# EAGLE design Challenger-2040 (EAGLE 9.6.2)
COMPANY: Invector Labs; DRAWN: P. Oldberg; DRGNO: 10/98-00168-1; REV: 0.2

## Sheet 1 of 2
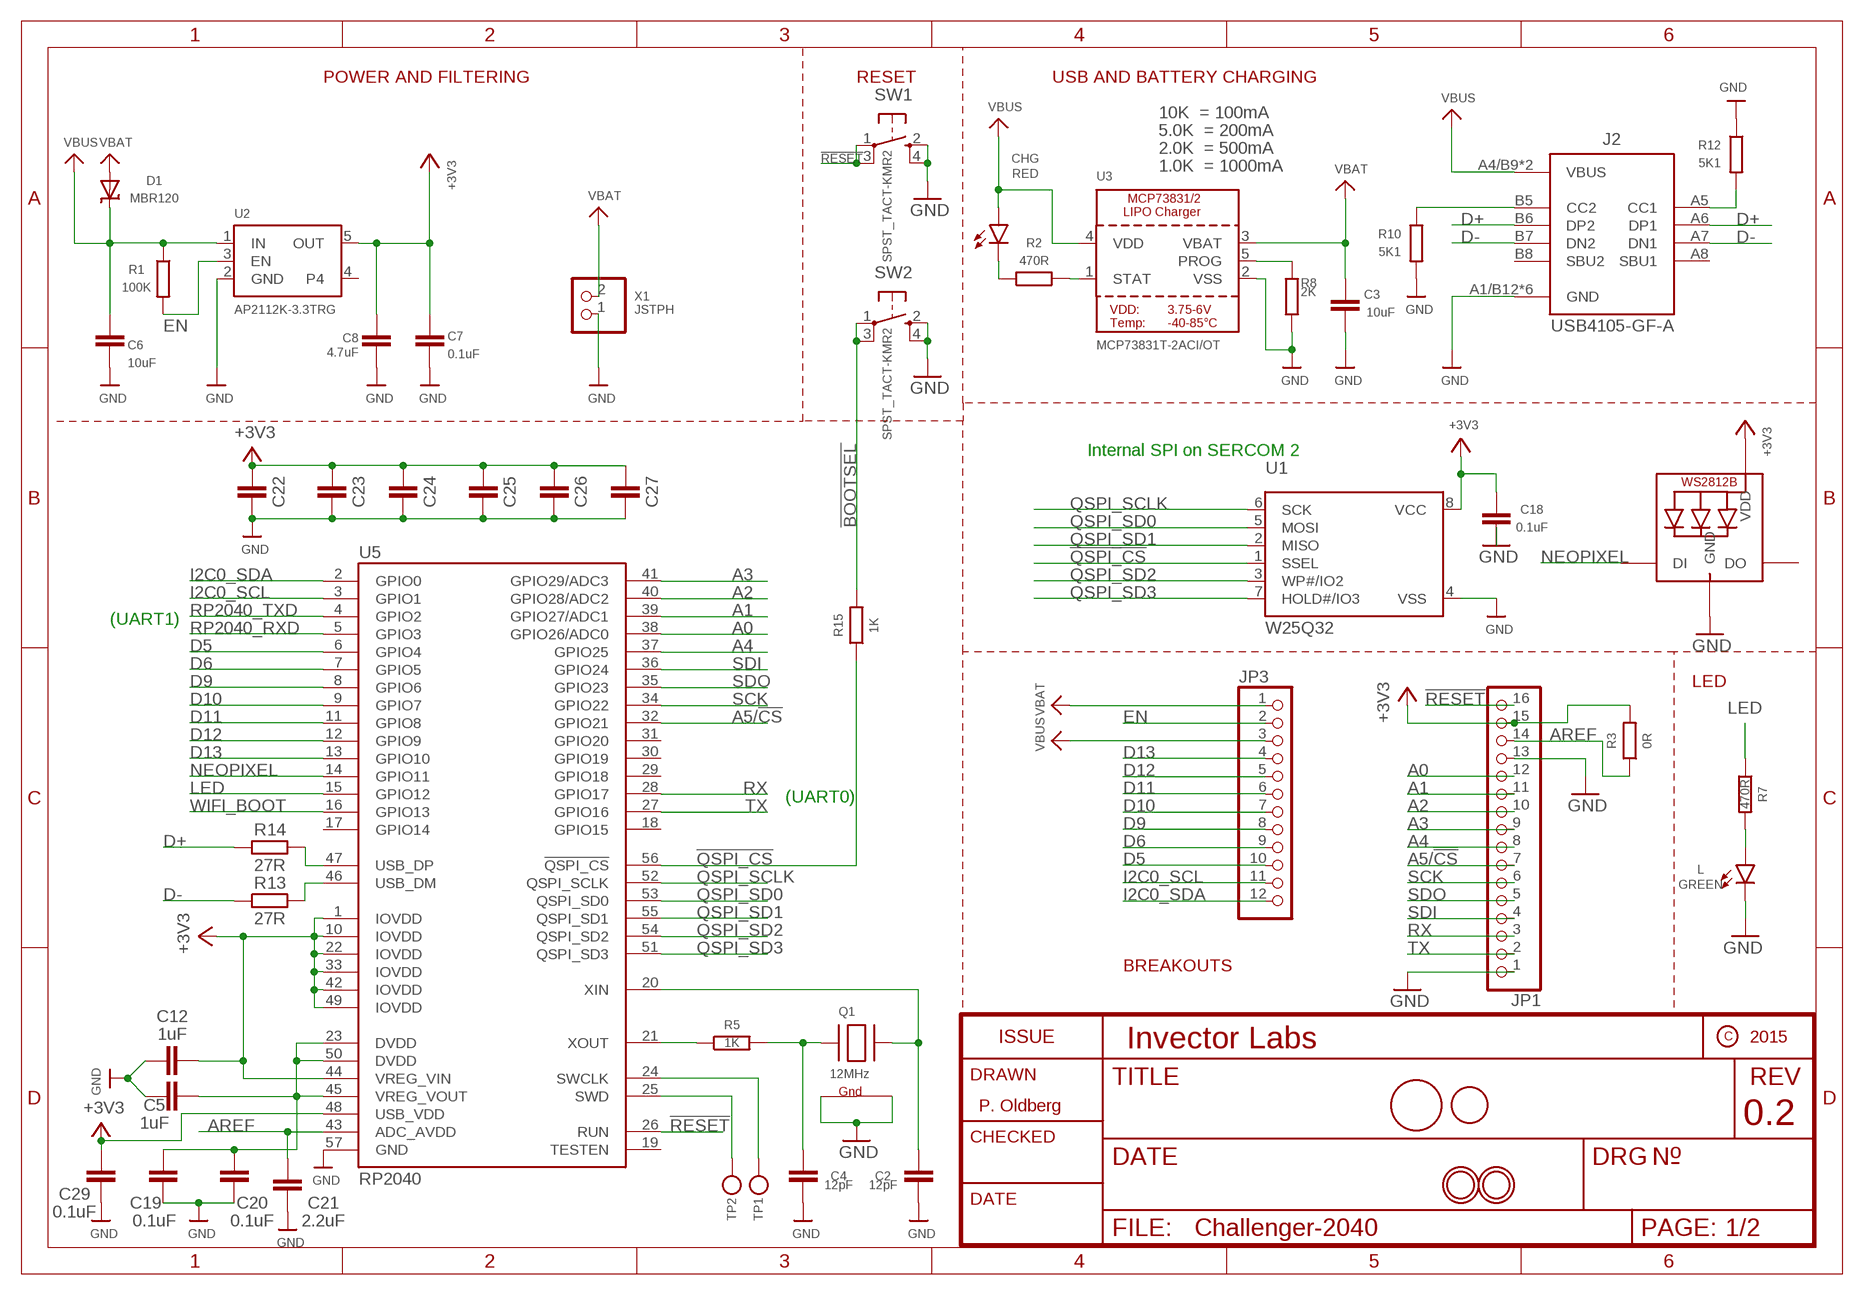
[diagram p0: schematic, sheet 1]

### Parts
C2  12pF  C_CHIP-0402(1005-METRIC)  [CAPC1005X60]
C3  10uF  C_CHIP-0603(1608-METRIC)  [CAPC1608X85]
C4  12pF  C_CHIP-0402(1005-METRIC)  [CAPC1005X60]
C5  1uF  C_CHIP-0402(1005-METRIC)  [CAPC1005X60]
C6  10uF  C_CHIP-0603(1608-METRIC)  [CAPC1608X85]
C7  0.1uF  C_CHIP-0402(1005-METRIC)  [CAPC1005X60]
C8  4.7uF  C_CHIP-0402(1005-METRIC)  [CAPC1005X60]
C12  1uF  C_CHIP-0402(1005-METRIC)  [CAPC1005X60]
C18  0.1uF  C_CHIP-0402(1005-METRIC)  [CAPC1005X60]
C19  0.1uF  C_CHIP-0402(1005-METRIC)  [CAPC1005X60]
C20  0.1uF  C_CHIP-0402(1005-METRIC)  [CAPC1005X60]
C21  2.2uF  C_CHIP-0402(1005-METRIC)  [CAPC1005X60]
C22  C_CHIP-0402(1005-METRIC)  [CAPC1005X60]
C23  C_CHIP-0402(1005-METRIC)  [CAPC1005X60]
C24  C_CHIP-0402(1005-METRIC)  [CAPC1005X60]
C25  C_CHIP-0402(1005-METRIC)  [CAPC1005X60]
C26  C_CHIP-0402(1005-METRIC)  [CAPC1005X60]
C27  C_CHIP-0402(1005-METRIC)  [CAPC1005X60]
C29  0.1uF  C_CHIP-0402(1005-METRIC)  [CAPC1005X60]
CHG  RED  LEDCHIPLED_0603  [CHIPLED_0603]
D1  MBR120  DIODE-SCHOTTKYSOD-123  [SOD-123]
J2  USB4105-GF-A  [GCT_USB4105-GF-A]
JP1  HEADER-1X16ROUND  [1X16_ROUND]
JP3  HEADER-1X12  [1X12_ROUND]
L  GREEN  LEDCHIPLED_0603  [CHIPLED_0603]
LED1  WS2812B3535  [LED3535]
LOGO1  CHALENGER-11MM  [CHALLENGER]
Q1  12MHz  XTAL-4-3225  [NX3225]
R1  100K  R_CHIP-0402(1005-METRIC)  [RESC1005X40]
R2  470R  R_CHIP-0402(1005-METRIC)  [RESC1005X40]
R3  0R  R_CHIP-0402(1005-METRIC)  [RESC1005X40]
R5  1K  R_CHIP-0402(1005-METRIC)  [RESC1005X40]
R7  470R  R_CHIP-0402(1005-METRIC)  [RESC1005X40]
R8  2K  R_CHIP-0402(1005-METRIC)  [RESC1005X40]
R10  5K1  R_CHIP-0402(1005-METRIC)  [RESC1005X40]
R12  5K1  R_CHIP-0402(1005-METRIC)  [RESC1005X40]
R13  27R  R_CHIP-0402(1005-METRIC)  [RESC1005X40]
R14  27R  R_CHIP-0402(1005-METRIC)  [RESC1005X40]
R15  1K  R_CHIP-0402(1005-METRIC)  [RESC1005X40]
SW1  SPST_TACT-KMR2  [KMR2]
SW2  SPST_TACT-KMR2  [KMR2]
TP1  TESTPOINTROUND1.5MM  [TESTPOINT_ROUND_1.5MM]
TP2  TESTPOINTROUND1.5MM  [TESTPOINT_ROUND_1.5MM]
U1  W25Q32  SPIFLASH_SOIC8208MIL  [SOIC8_208MIL]
U2  AP2112K-3.3TRG  VREG_SOT23-5  [SOT23-5]
U3  MCP73831T-2ACI/OT  MCP73831/2  [SOT23-5]
U5  RP2040  [QFN40P700X700X90-57T310N]
U$11  CHAL-TEXT  [CHAL-TEXT]
U$31  MOUNTINGHOLE2.5  [MOUNTINGHOLE_2.5_PLATED]
U$32  MOUNTINGHOLE2.5  [MOUNTINGHOLE_2.5_PLATED]
X1  JSTPH  CON_JST_PH_2PIN  [JSTPH2]

### Nets
!BOOTSEL: R15.2 SW2.1(P) SW2.3(P1)
!QSPI_CS: R15.1 U1.1(SSEL) U5.56(!QSPI_CS)
!RESET: JP1.16 SW1.1(P) SW1.3(P1) U5.26(RUN)
+3V3: C7.1 C8.1 C12.2 C18.1 C22.2 C23.2 C24.2 C25.2 C26.2 C27.2 C29.2 JP1.15 LED1.2(VDD) R3.2 U1.8(VCC) U2.5(OUT) U5.1(IOVDD) U5.10(IOVDD) U5.22(IOVDD) U5.33(IOVDD) U5.42(IOVDD) U5.44(VREG_VIN) U5.48(USB_VDD) U5.49(IOVDD) ; also sheet 2
A0: JP1.12 U5.38(GPIO26/ADC0)
A1: JP1.11 U5.39(GPIO27/ADC1)
A2: JP1.10 U5.40(GPIO28/ADC2)
A3: JP1.9 U5.41(GPIO29/ADC3)
A4: JP1.8 U5.37(GPIO25)
A5/!CS: JP1.7 U5.32(GPIO21)
AREF: C21.2 JP1.14 R3.1 U5.43(ADC_AVDD)
D5: JP3.10 U5.6(GPIO4)
D6: JP3.9 U5.7(GPIO5)
D9: JP3.8 U5.8(GPIO6)
D10: JP3.7 U5.9(GPIO7)
D11: JP3.6 U5.11(GPIO8)
D12: JP3.5 U5.12(GPIO9)
D13: JP3.4 U5.13(GPIO10)
D+: J2.A6(DP1) J2.B6(DP2) R14.1
D-: J2.A7(DN1) J2.B7(DN2) R13.1
EN: JP3.2 R1.2 U2.3(EN)
GND: C2.2 C3.2 C4.2 C5.1 C6.2 C7.2 C8.2 C12.1 C18.2 C19.1 C20.1 C21.1 C22.1 C23.1 C24.1 C25.1 C26.1 C27.1 C29.1 J2.A1/B12(GND) J2.B1/A12(GND) J2.G1(GND) J2.G2(GND) J2.G3(GND) J2.G4(GND) JP1.1 JP1.13 L.C LED1.4(GND) Q1.2(G2) Q1.4(G1) R8.2 R10.2 R12.1 SW1.2(S) SW1.4(S1) SW2.2(S) SW2.4(S1) U1.4(VSS) U2.2(GND) U3.2(VSS) U5.57(GND) X1.1 ; also sheet 2
I2C0_SCL: JP3.11 U5.3(GPIO1)
I2C0_SDA: JP3.12 U5.2(GPIO0)
LED: R7.1 U5.15(GPIO12)
N$1: CHG.C R2.1
N$2: L.A R7.2
N$3: R2.2 U3.1(STAT)
N$4: R8.1 U3.5(PROG)
N$5: R13.2 U5.46(USB_DM)
N$7: R14.2 U5.47(USB_DP)
N$11: J2.B5(CC2) R10.1
N$12: J2.A5(CC1) R12.2
N$13: C2.1 Q1.3(X2) U5.20(XIN)
N$14: TP1.P$1 U5.24(SWCLK)
N$15: TP2.P$1 U5.25(SWD)
N$16: C4.1 Q1.1(X1) R5.2
N$17: R5.1 U5.21(XOUT)
N$18: C5.2 C19.2 C20.2 U5.23(DVDD) U5.45(VREG_VOUT) U5.50(DVDD)
NEOPIXEL: LED1.1(DI) U5.14(GPIO11)
QSPI_SCLK: U1.6(SCK) U5.52(QSPI_SCLK)
QSPI_SD0: U1.5(MOSI) U5.53(QSPI_SD0)
QSPI_SD1: U1.2(MISO) U5.55(QSPI_SD1)
QSPI_SD2: U1.3(WP#/IO2) U5.54(QSPI_SD2)
QSPI_SD3: U1.7(HOLD#/IO3) U5.51(QSPI_SD3)
RP2040_RXD: U5.5(GPIO3) ; also sheet 2
RP2040_TXD: U5.4(GPIO2) ; also sheet 2
RX: JP1.3 U5.28(GPIO17)
SCK: JP1.6 U5.34(GPIO22)
SDI: JP1.4 U5.36(GPIO24)
SDO: JP1.5 U5.35(GPIO23)
TX: JP1.2 U5.27(GPIO16)
VBAT: C3.1 D1.A JP3.1 U3.3(VBAT) X1.2
VBUS: C6.1 CHG.A D1.C J2.A4/B9(VBUS) J2.B4/A9(VBUS) JP3.3 R1.1 U2.1(IN) U3.4(VDD)
WIFI_BOOT: U5.16(GPIO13) ; also sheet 2
Unconnected: J2.A8(SBU1) J2.B8(SBU2) LED1.3(DO) U2.4 U5.17(GPIO14) U5.18(GPIO15) U5.19(TESTEN) U5.29(GPIO18) U5.30(GPIO19) U5.31(GPIO20)

### Notes on the sheet
- POWER AND FILTERING | RESET | USB AND BATTERY CHARGING
- 10K  = 100mA
- 5.0K  = 200mA
- 2.0K  = 500mA
- 1.0K  = 1000mA
- Internal SPI on SERCOM 2
- (UART1)
- LED
- (UART0)
- BREAKOUTS

## Sheet 2 of 2
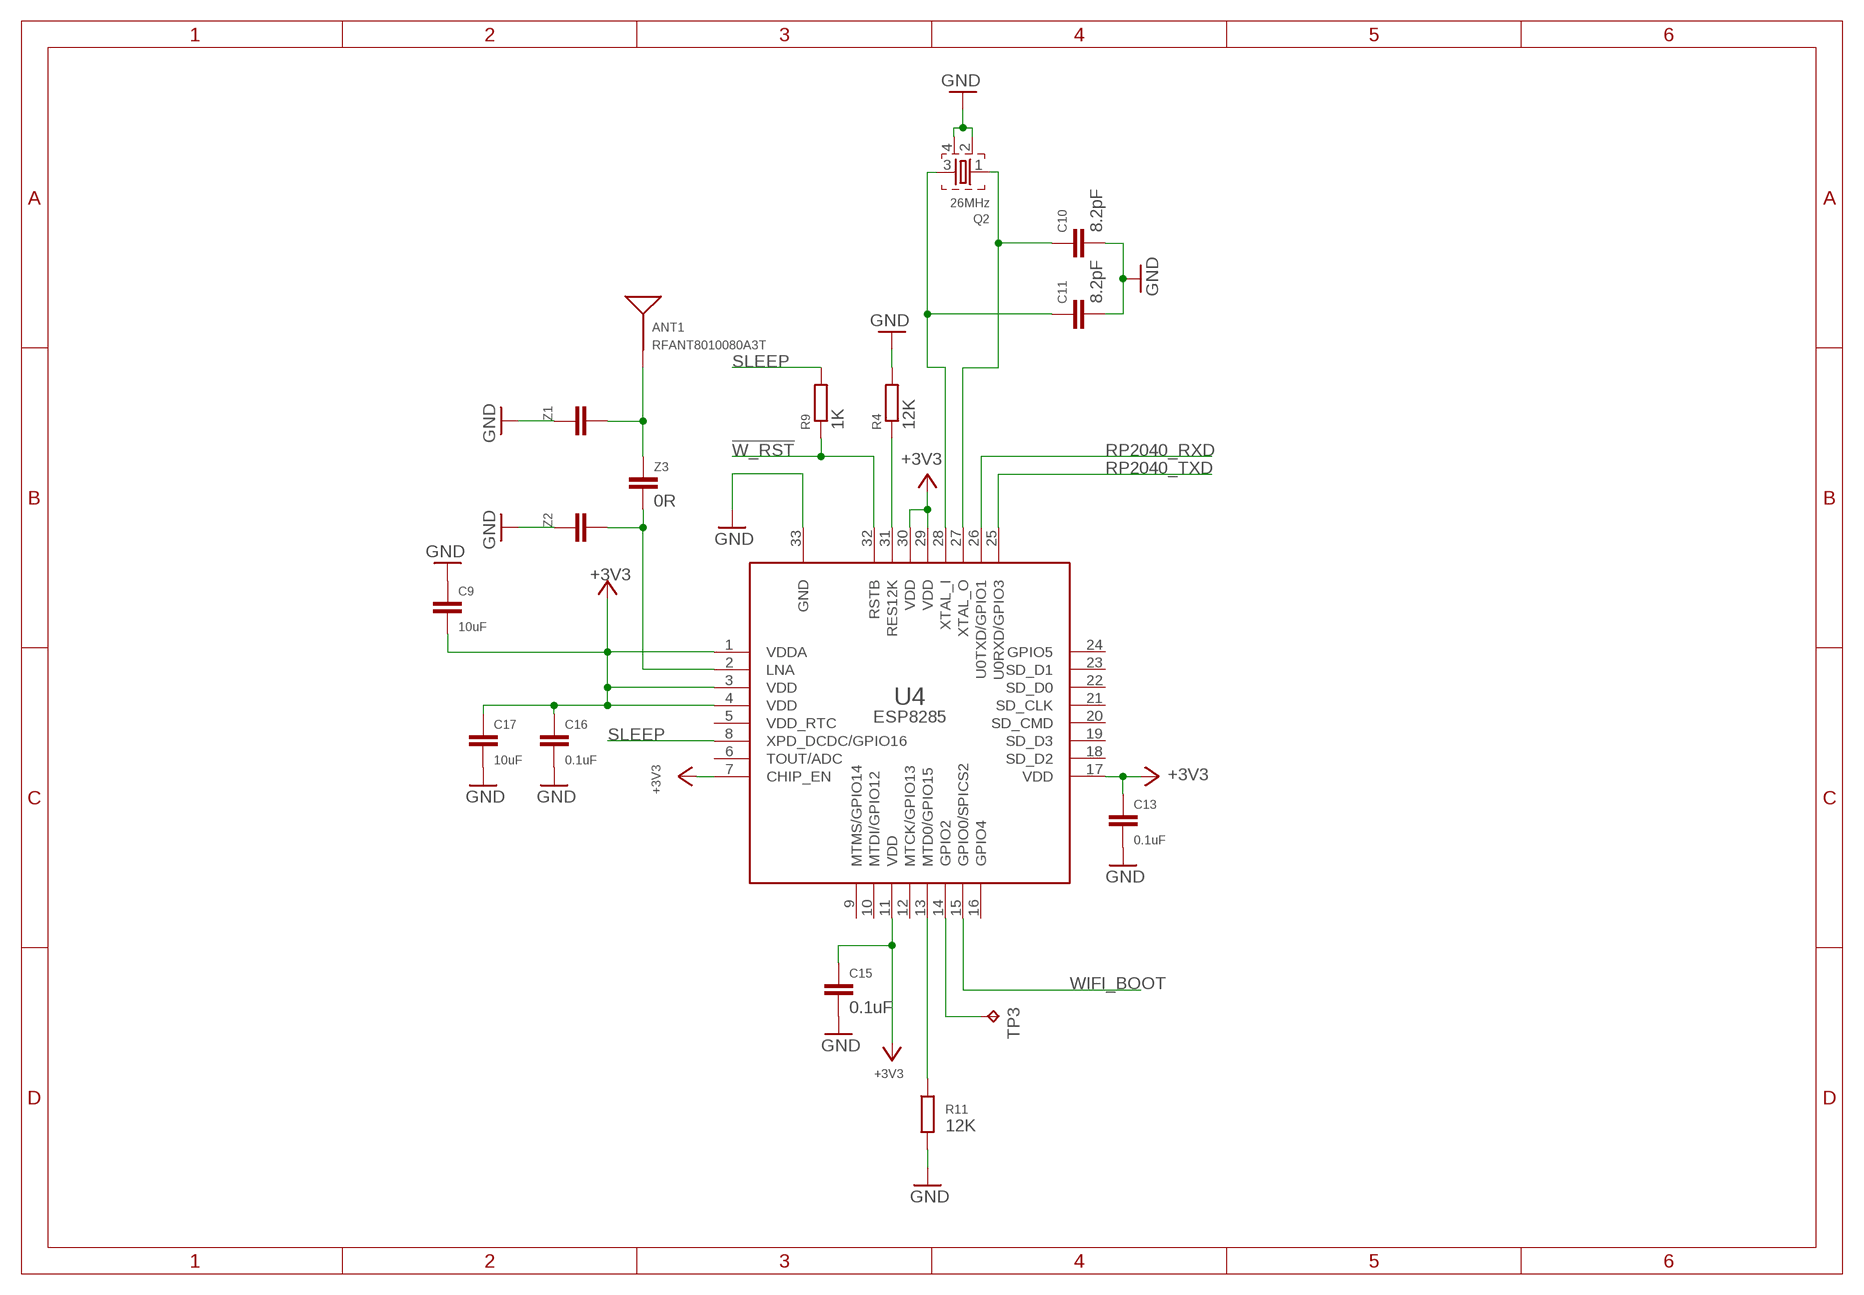
[diagram p1: schematic, sheet 2]

### Parts
ANT1  RFANT8010080A3T  ANTENNA2SMD6  [ANTENNA-CHIP6]
C9  10uF  C_CHIP-0603(1608-METRIC)  [CAPC1608X85]
C10  8.2pF  C_CHIP-0402(1005-METRIC)  [CAPC1005X60]
C11  8.2pF  C_CHIP-0402(1005-METRIC)  [CAPC1005X60]
C13  0.1uF  C_CHIP-0402(1005-METRIC)  [CAPC1005X60]
C15  0.1uF  C_CHIP-0402(1005-METRIC)  [CAPC1005X60]
C16  0.1uF  C_CHIP-0402(1005-METRIC)  [CAPC1005X60]
C17  10uF  C_CHIP-0603(1608-METRIC)  [CAPC1608X85]
Q2  26MHz  FA-128  [FA-128]
R4  12K  R_CHIP-0402(1005-METRIC)  [RESC1005X40]
R9  1K  R_CHIP-0402(1005-METRIC)  [RESC1005X40]
R11  12K  R_CHIP-0402(1005-METRIC)  [RESC1005X40]
TP3  TPB1,27  [B1,27]
U4  ESP8285  ESP8266EXT  [SLP32]
Z1  C_CHIP-0402(1005-METRIC)  [CAPC1005X60]
Z2  C_CHIP-0402(1005-METRIC)  [CAPC1005X60]
Z3  0R  C_CHIP-0402(1005-METRIC)  [CAPC1005X60]

### Nets
!W_RST: R9.1 U4.32(RSTB)
+3V3: C9.2 C13.1 C15.1 C16.1 C17.1 U4.1(VDDA) U4.3(VDD) U4.4(VDD) U4.7(CHIP_EN) U4.11(VDD) U4.17(VDD) U4.29(VDD) U4.30(VDD) ; also sheet 1
GND: C9.1 C10.2 C11.2 C13.2 C15.2 C16.2 C17.2 Q2.2 Q2.4 R4.2 R11.2 U4.33(GND) Z1.1 Z2.1 ; also sheet 1
N$6: R4.1 U4.31(RES12K)
N$8: C10.1 Q2.1 U4.27(XTAL_O)
N$9: TP3.TP U4.14(GPIO2)
N$10: C11.1 Q2.3 U4.28(XTAL_I)
N$123: R11.1 U4.13(MTD0/GPIO15)
RF1 [RF]: U4.2(LNA) Z2.2 Z3.2
RF2 [RF]: ANT1.1(SIGNAL) Z1.2 Z3.1
RP2040_RXD: U4.26(U0TXD/GPIO1) ; also sheet 1
RP2040_TXD: U4.25(U0RXD/GPIO3) ; also sheet 1
SLEEP: R9.2 U4.8(XPD_DCDC/GPIO16)
WIFI_BOOT: U4.15(GPIO0/SPICS2) ; also sheet 1
Unconnected: U4.5(VDD_RTC) U4.6(TOUT/ADC) U4.9(MTMS/GPIO14) U4.10(MTDI/GPIO12) U4.12(MTCK/GPIO13) U4.16(GPIO4) U4.18(SD_D2) U4.19(SD_D3) U4.20(SD_CMD) U4.21(SD_CLK) U4.22(SD_D0) U4.23(SD_D1) U4.24(GPIO5)

## Library data of the parts
ANT1 = SparkFun-RF:ANTENNA2: Chip antenna Single endded antenna. Common with smaller chip antennas. CHIP4 package is the GPS Chip Antenna SKU: GPS-08418. CHIP5 package is 2.4GHz chip antenna SKU: WRL-00144.
C2-C13 C15-C27 C29 Z1-Z3 = Capacitor:C: Capacitor - Generic; CATEGORY: Capacitor
CHG L = new_led:LED: LED OSRAM: - CHIPLED LG R971, LG N971, LY N971, LG Q971, LY Q971, LO R971, LY R971 LH N974, LH R974 LS Q976, LO Q976, LY Q976 LO Q996 - Hyper CHIPLED LW Q18S LB Q993, LB Q99A, LB R99A - SideLED LS A670, LO A670, LY A670, LG A670, LP A670 LB A673, LV A673, LT A673, LW A673 LH A674 LY A675 LS A676, LA A676, LO A676, LY A676, LW A676 LS A679, LY A679, LG A679 - Hyper Micro SIDELED® LS Y876, LA Y876, LO Y876, LY Y876 LT Y87S - SmartLED LW L88C, LW L88S LB L89C, LB L89S, LG L890 LS L89K, LO L89K, LY L89K LS L896, LA L896, LO L896, LY L896 - TOPLED LS T670, LO T670, LY T670, LG T670, LP T670 LSG T670, LSP T670, LSY T670, LOP T670, LYG T670 LG T671, LOG T671, LSG T671 LB T673, LV T673, LT T673, LW T673 LH T674 LS T676, LA T676, LO T676, LY T676, LB T676, LH T676, LSB T676, LW T676 LB T67C, LV T67C, LT T67C, LS T67K, LO T67K, LY T67K, LW E67C LS E67B, LA E67B, LO E67B, LY E67B, LB E67C, LV E67C, LT E67C LW T67C LS T679, LY T679, LG T679 LS T770, LO T770, LY T770, LG T770, LP T770 LB T773, LV T773, LT T773, LW T773 LH T774 LS E675, LA E675, LY E675, LS T675 LS T776, LA T776, LO T776, LY T776, LB T776 LHGB T686 LT T68C, LB T68C - Hyper Mini TOPLED® LB M676 - Mini TOPLED Santana® LG M470 LS M47K, LO M47K, LY M47K Source: http://www.osram.convergy.de LUXEON: - LUMILED® LXK2-PW12-R00, LXK2-PW12-S00, LXK2-PW14-U00, LXK2-PW14-V00 LXK2-PM12-R00, LXK2-PM12-S00, LXK2-PM14-U00 LXK2-PE12-Q00, LXK2-PE12-R00, LXK2-PE12-S00, LXK2-PE14-T00, LXK2-PE14-U00 LXK2-PB12-K00, LXK2-PB12-L00, LXK2-PB12-M00, LXK2-PB14-N00, LXK2-PB14-P00, LXK2-PB14-Q00 LXK2-PR12-L00, LXK2-PR12-M00, LXK2-PR14-Q00, LXK2-PR14-R00 LXK2-PD12-Q00, LXK2-PD12-R00, LXK2-PD12-S00 LXK2-PH12-R00, LXK2-PH12-S00 LXK2-PL12-P00, LXK2-PL12-Q00, LXK2-PL12-R00 Source: www.luxeon.com KINGBRIGHT: KA-3528ASYC Source: www.kingbright.com
D1 = microbuilder:DIODE-SCHOTTKY
J2 = USB4105-GF-A:USB4105-GF-A: USB Type C Receptacle for USB 2.0 SMT Type, PCB Top Mount; AVAILABILITY: Unavailable; DESCRIPTION: USB-C (USB TYPE-C) USB 2.0 Receptacle Connector 24 (16+8 Dummy) Position Surface Mount, Right Angle; Through Hole; MF: GCT; MP: USB4105-GF-A; PACKAGE: None; PRICE: None
JP1 = microbuilder:HEADER-1X16: PIN HEADER
JP3 = microbuilder:HEADER-1X12
LED1 = microbuilder:WS2812B
LOGO1 = ilabs-pictures:CHALENGER-11MM
Q1 = adafruit:XTAL-4: Classic 4-pin 3.2 x 2.5mm crystal
Q2 = crystal:FA-: MHz RANGE CRYSTAL UNIT Source: Epson Toyocom
R1-R5 R7-R15 = Resistor:R: Resistor Fixed - Generic; CATEGORY: Resistor; SUB-CATEGORY: Fixed
SW1 SW2 = adafruit:SPST_TACT: SMT 6mm switch, EVQQ2 series http://www.ladyada.net/library/eagle
TP1 TP2 = microbuilder:TESTPOINT: Test Point Various test points for characterisation and PCB testing TESTPOINT_SMT - Compact Surface Mount Test Point [Digikey: 5016KTR-ND]
TP3 = testpad:TP: Test pad
U1 = microbuilder:SPIFLASH_SOIC8: SOIC8 SPI Flash Be careful with the size since SOIC8 flash comes in several 'widths' SOIC8 150 mil M25P16 - 16Mbit (2Mbit x 8) Serial Flash (75MHz SPI Bus), Supply: 2.7-3.6V Digikey: SOIC8 - M25P16-VMN6P-ND SOIC8 208 mil W25Q16BVSSIG - 16Mbit (2Mbit x 8) Serial Flash (104MHz SPI Bus), Supply: 2.7-3.6V Digikey: SOIC8 - W25Q16BVSSIG-ND
U2 = microbuilder:VREG_SOT23-5: SOT23-5 Fixed Voltage Regulators Part Current Out V Out V In V Dropout θJA (°C/W) TJ (°C) Digikey Part No. ADP121 150mA 3.3V 3.4-5.5V 0.09V @ 150mA -- -- ADP121-AUJZ33R7CT-ND ADP121 150mA 3.0V 3.1-5.5V 0.09V @ 150mA -- -- ADP121-AUJZ30R7CT-ND ADP122 300mA 3.3V 3.4-5.5V 0.085V @ 300mA -- -- ADP122AUJZ-3.3-R7CT-ND ADP1712 300mA 3.3V 3.5-5.5V 0.17V @ 300mA -- -- ADP1712AUJZ-3.3-R7TR-ND AP7311 (Low Cost) 150mA 3.3V 3.5-6V 0.15V @ 150mA -- -- AP7311-33WG-7DICT-ND LD39015M18R 150mA 1.8V 1.9V-5.5V 0.08V @ 100mA -- -- 497-6977-1-ND LP2985A-33DBVR 150mA 3.3V 3.3-16V 0.28V @ 150mA 206 150 296-18479-1-ND MCP1824T-3302E/OT 300mA 3.3V 3.5V-6V 0.2V @ 300mA -- -- MCP1824T-3302E/OTCT-ND MIC5205-2.5YM5 TR 150mA 2.5V 2.7-16V 0.165V @ 150mA -- -- 576-1257-2-ND MIC5205-3.0YM5 TR 150mA 3.0V 3.2V-16V 0.165V @ 150mA -- -- 576-1258-2-ND MIC5205-3.3YM5 TR 150mA 3.3V 3.5V-16V 0.165V @ 150mA -- -- 576-1259-2-ND TPS780330220 150mA 3.3V+2.2V 3.6-5.5V 250mV Max -- -- 296-23332-1-ND TDA3663/N1,135 100mA 3.3V 3.5-45V 0.18V @ 50mA -- -- 568-5343-1-ND Max operating temp can be calculated using θJA, TJ (max junction temperature), and power in watts. Set the "Maximum Ambient Temperature" until it reaches TJ ("Max Junction Temperature"), which is the absolute limit for safe use of the regulator: Heat Sink Temperature Calculator <http://www.daycounter.com/Calculators/Heat-Sink-Temperature-Calculator.phtml> For example, With 12V source into a 3.3V LP2985 and a 30mA load, we are dissipating (12V-3.3V) * 0.03A = 0.261W. With a θJA of 206 °C/W, a TJ of 150°C, and 261mW we can safely use the chip without a heat sink up to 75°C (=147.1°C Junction Temperature).
U3 = microbuilder:MCP73831/2: MCP73831/2 LIPO Charger VDD: 3.75 - 6V Temp -40 - 85°C Programmable Charge Rate: 15-500mA NOTE: STAT is a tri-state logic output on the MCP73831 and an open-drain output on the MCP73832. SOT23-5 with 4.2V output and tri-state logic on STAT = MCP73831T-2ACI/OT
U4 = espressif:ESP8266EX
U5 = raspberrypi:RP2040
U$11 = ilabs-pictures:CHAL-TEXT
U$31 U$32 = microbuilder:MOUNTINGHOLE: Mounting Hole For #2 screws (0.086"/2.18mm width, 0.094"/2.4mm hole) use 2.5mm; BOM: EXCLUDE
X1 = microbuilder:CON_JST_PH_2PIN: JST 2-Pin Right-Angle Connector PH-Series - 4UConnector: 17311 SH-Series - 4UConnector: 07278

## Net classes
1 RF: width 0.75 mm, clearance 0.15 mm

## Board
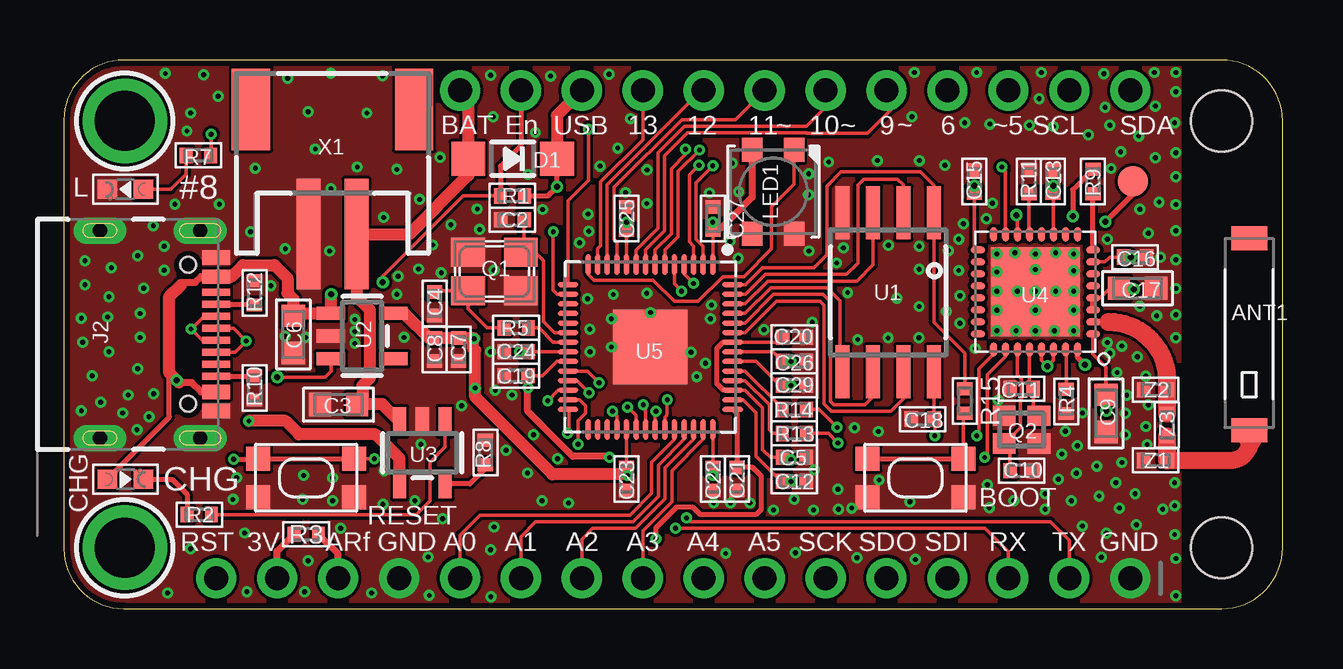
[diagram p2: board, top side]
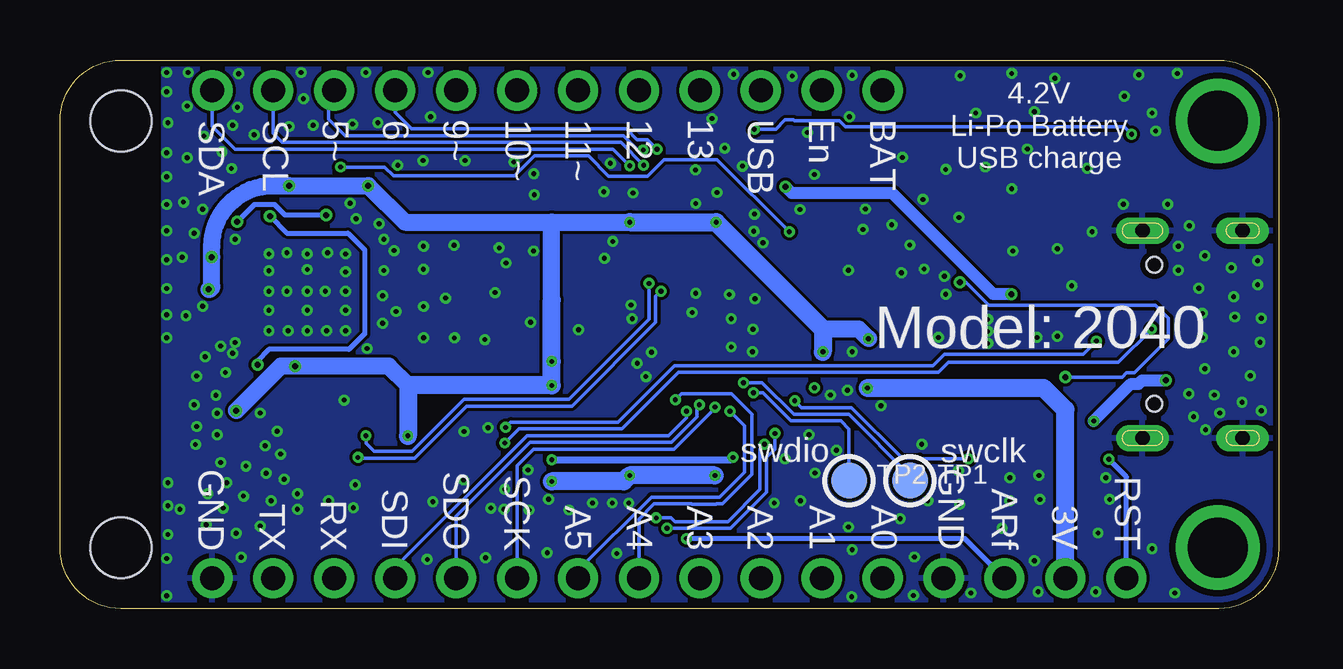
[diagram p3: board, bottom side, seen from below]

Size 50.8 x 22.86 mm. Coordinates in mm from the lower left corner, seen from the top.
Outline: 0,20.36 0,2.5 arc90 2.5,0 48.26,0 arc90 50.8,2.54 50.8,20.32 arc90 48.26,22.86 2.5,22.86 arc90 0,20.36
Copper layers (1*16): Top 0.035mm / dielectric 1.5mm / Bottom 0.035mm
Design rules "adafruit *": minimum track width 5mil, minimum drill 0.2mm, track to track 5mil, track to pad 5mil, pad to pad 5mil, via to via 5mil, smd to smd 5mil, copper to edge 10mil, drill to drill 8mil, minimum pad ring 10mil, minimum via ring 5mil, stop-mask expansion 2mil, vias tented up to drill 0.3mm, thermal gap 8mil
Holes 2.54 mm at 48.26,20.32 48.26,2.54

### Footprints (pad centres in the part's own frame; a part is rotated, then mirrored left to right if it is on the bottom)
ANTENNA-CHIP6 = smd 1 x 1.5: 1 -4,0; NC 4,0
CAPC1005X60 = smd 0.56 x 0.629: 1 -0.485,0; 2 0.485,0
CAPC1608X85 = smd 0.921 x 0.97: 1 -0.775,0; 2 0.775,0
CHIPLED_0603 = smd 0.8 x 0.8: A 0,-0.75; C 0,0.75
SOD-123 = smd 1.4 x 1.4: A 1.85,0; C -1.85,0
GCT_USB4105-GF-A = smd 0.6 x 1.15: A1/B12 -3.2,4.85; A4/B9 -2.4,4.85; B1/A12 3.2,4.85; B4/A9 2.4,4.85 | smd 0.3 x 1.15: A5 -1.25,4.85; A6 -0.25,4.85; A7 0.25,4.85; A8 1.25,4.85; B5 1.75,4.85; B6 0.75,4.85; B7 -0.75,4.85; B8 -1.75,4.85 | drill 0.6 pad 1 long: G1 -4.32,0; G2 4.32,0 | drill 0.6 pad 1.05 long: G3 -4.32,4.18; G4 4.32,4.18 | hole 0.65: 2.89,3.68; -2.89,3.68
1X16_ROUND = drill 1 pad 1.676: 1 -19.05,0; 2 -16.51,0; 3 -13.97,0; 4 -11.43,0; 5 -8.89,0; 6 -6.35,0; 7 -3.81,0; 8 -1.27,0; 9 1.27,0; 10 3.81,0; 11 6.35,0; 12 8.89,0; 13 11.43,0; 14 13.97,0; 15 16.51,0; 16 19.05,0
1X12_ROUND = drill 1 pad 1.676: 1 -13.97,0; 2 -11.43,0; 3 -8.89,0; 4 -6.35,0; 5 -3.81,0; 6 -1.27,0; 7 1.27,0; 8 3.81,0; 9 6.35,0; 10 8.89,0; 11 11.43,0; 12 13.97,0
LED3535 = smd 1 x 0.85: 1 -1.75,0.875; 2 -1.75,-0.875; 3 1.75,-0.875; 4 1.75,0.875
NX3225 = smd 1.4 x 1.2: 1 -1.1,-0.8; 2 1.1,-0.8; 3 1.1,0.8; 4 -1.1,0.8
FA-128 = smd 0.95 x 0.85: 1 -0.725,-0.575; 2 0.725,-0.575; 3 0.725,0.575; 4 -0.725,0.575
RESC1005X40 = smd 0.535 x 0.644: 1 -0.507,0; 2 0.507,0
KMR2 = smd 1 x 1: 1 2,0.8; 2 2,-0.8; 3 -2,0.8; 4 -2,-0.8
TESTPOINT_ROUND_1.5MM = smd 1.5 x 1.5: P$1 0,0
B1,27 = smd 1.27 x 1.27: TP 0,0
SOIC8_208MIL = smd 0.6 x 2.2: 1 -1.905,-3.315; 2 -0.635,-3.315; 3 0.635,-3.315; 4 1.905,-3.315; 5 1.905,3.315; 6 0.635,3.315; 7 -0.635,3.315; 8 -1.905,3.315
SOT23-5 = smd 0.55 x 1.2: 1 -0.95,-1.3; 2 0,-1.3; 3 0.95,-1.3; 4 0.95,1.3; 5 -0.95,1.3
SLP32 = smd 0.6 x 0.3: 1 -2.4,1.75; 2 -2.4,1.25; 3 -2.4,0.75; 4 -2.4,0.25; 5 -2.4,-0.25; 6 -2.4,-0.75; 7 -2.4,-1.25; 8 -2.4,-1.75; 17 2.4,-1.75; 18 2.4,-1.25; 19 2.4,-0.75; 20 2.4,-0.25; 21 2.4,0.25; 22 2.4,0.75; 23 2.4,1.25; 24 2.4,1.75 | smd 0.3 x 0.6: 9 -1.75,-2.4; 10 -1.25,-2.4; 11 -0.75,-2.4; 12 -0.25,-2.4; 13 0.25,-2.4; 14 0.75,-2.4; 15 1.25,-2.4; 16 1.75,-2.4; 25 1.75,2.4; 26 1.25,2.4; 27 0.75,2.4; 28 0.25,2.4; 29 -0.25,2.4; 30 -0.75,2.4; 31 -1.25,2.4; 32 -1.75,2.4 | smd 3.7 x 3.7: 33 0,0
QFN40P700X700X90-57T310N = smd 0.86 x 0.2: 1 -3.435,2.6; 2 -3.435,2.2; 3 -3.435,1.8; 4 -3.435,1.4; 5 -3.435,1; 6 -3.435,0.6; 7 -3.435,0.2; 8 -3.435,-0.2; 9 -3.435,-0.6; 10 -3.435,-1; 11 -3.435,-1.4; 12 -3.435,-1.8; 13 -3.435,-2.2; 14 -3.435,-2.6; 29 3.435,-2.6; 30 3.435,-2.2; 31 3.435,-1.8; 32 3.435,-1.4; 33 3.435,-1; 34 3.435,-0.6; 35 3.435,-0.2; 36 3.435,0.2; 37 3.435,0.6; 38 3.435,1; 39 3.435,1.4; 40 3.435,1.8; 41 3.435,2.2; 42 3.435,2.6 | smd 0.2 x 0.86: 15 -2.6,-3.435; 16 -2.2,-3.435; 17 -1.8,-3.435; 18 -1.4,-3.435; 19 -1,-3.435; 20 -0.6,-3.435; 21 -0.2,-3.435; 22 0.2,-3.435; 23 0.6,-3.435; 24 1,-3.435; 25 1.4,-3.435; 26 1.8,-3.435; 27 2.2,-3.435; 28 2.6,-3.435; 43 2.6,3.435; 44 2.2,3.435; 45 1.8,3.435; 46 1.4,3.435; 47 1,3.435; 48 0.6,3.435; 49 0.2,3.435; 50 -0.2,3.435; 51 -0.6,3.435; 52 -1,3.435; 53 -1.4,3.435; 54 -1.8,3.435; 55 -2.2,3.435; 56 -2.6,3.435 | smd 3.1 x 3.1: 57 0,0
MOUNTINGHOLE_2.5_PLATED = drill 2.5 pad 3.2: P$1 0,0
JSTPH2 = smd 1 x 4.6: 1 -1,-3.7; 2 1,-3.7 | smd 1.6 x 3.4: NC1 -3.4,1.5; NC2 3.4,1.5

### Placement (x,y rotation side)
ANT1  49.4,11.43 90 top
C2  18.7,16.2 180 top
C3  11.45,8.5 180 top
C4  15.45,12.71 270 top
C5  30.45,6.3 180 top
C6  9.56,11.43 270 top
C7  16.45,10.8 270 top
C8  15.45,10.8 270 top
C9  43.44,8.14 90 top
C10  39.92,5.75 0 top
C11  39.92,9.17 180 top
C12  30.45,5.3 180 top
C13  41.23,17.8 90 top
C15  37.95,17.8 90 top
C16  44.65,14.65 0 top
C17  44.75,13.35 0 top
C18  35.8,7.9 180 top
C19  18.85,9.7 0 top
C20  30.45,11.3 180 top
C21  28.05,5.4 90 top
C22  27.05,5.4 90 top
C23  23.45,5.4 90 top
C24  18.85,10.7 0 top
C25  23.45,16.25 270 top
C26  30.45,10.3 180 top
C27  27.05,16.25 270 top
C29  30.45,9.3 180 top
CHG  2.56,5.39 270 top
D1  18.7,18.74 180 top
J2  1.5,11.43 270 top
JP1  25.4,1.27 180 top
JP3  30.48,21.59 0 top
L  2.56,17.47 90 top
LED1  29.56,17.37 270 top
LOGO1  44.5,5.45 0 bottom
Q1  17.95,14.05 0 top
Q2  39.92,7.46 0 top
R1  18.7,17.2 180 top
R2  5.65,3.92 0 top
R3  10.1,3.1 180 top
R4  41.78,8.64 270 top
R5  18.85,11.7 180 top
R7  5.61,18.89 180 top
R8  17.57,6.51 90 top
R9  42.9,17.8 270 top
R10  7.95,9.2 270 top
R11  40.23,17.8 90 top
R12  7.95,13.16 270 top
R13  30.45,7.3 180 top
R14  30.45,8.3 180 top
R15  37.55,8.65 270 top
SW1  10.1,5.45 0 top
SW2  35.5,5.45 0 top
TP1  15.37,5.33 0 bottom
TP2  17.91,5.33 0 bottom
TP3  44.55,17.8 0 top
U1  34.36,13.18 180 top
U2  12.43,11.36 270 top
U3  14.94,6.5 180 top
U4  40.5,13.2 180 top
U5  24.45,10.9 270 top
U$11  31.3,4.9 31 bottom
U$31  2.54,20.32 270 top
U$32  2.54,2.54 270 top
X1  11.2,19.3 0 top
Z1  45.5,6.17 0 top
Z2  45.5,9.12 0 top
Z3  45.98,7.65 90 top

### Tracks (layer width: path | path; a pad name or v marks a point on that pad's centre or on a via)
!BOOTSEL
  Top 0.152: R15.2 37.5,8.09 SW2.1
  Top 0.2: SW2.3 SW2.1
!QSPI_CS
  Top 0.152: U5.56 28.41,13.5 29.12,14.21 31.26,14.21 31.8,14.75 31.8,17.6 32.4,18.2 35.7,18.2 36.26,17.64 U1.1 36.26,11.94 37.55,10.65 R15.1
!RESET  (via drill 0.2)
  Top 0.152: U5.26 20.61,9.1 v20.17,8.67 | v12.94,6.24 SW1.1
  Top 0.2: v7.08,6.22 8.07,6.22 SW1.3 SW1.1
  Bottom 0.152: v20.17,8.67 19.88,8.38 17.8,8.38 15.71,6.29 14.97,6.29 14.93,6.24 v12.94,6.24
  Bottom 0.2: JP1.16 6.35,5.49 v7.08,6.22
!W_RST  (via drill 0.25)
  Top 0.2: R9.1 42.05,17.46 v42.05,16.35 | v42.56,10.16 42.25,10.48 U4.32
  Bottom 0.2: v42.05,16.35 41.35,15.65 38.8,15.65 38.1,14.95 38.1,11.45 38.75,10.8 42.1,10.8 42.56,10.34 v42.56,10.16
+3V3  (via drill 0.2, 0.25)
  Top 0.152: U5.42 C22.2 v27.05,5.55 | U5.33 C23.2 23.45,5.6 v23.5,5.55 | U1.8 36.26,7.92 C18.1 36.3,7.88 v36.3,7.2 | U5.22 C24.2 v19,10.7 | U5.10 C25.2 v23.45,16.1 | U5.49 29.57,10.7 C26.2 v30.3,10.3 | v30.3,5.3 30.25,5.25 30.02,5.25 C12.2 29.9,5.3 28.84,6.36 28.84,8.16 28.3,8.7 U5.44 | U5.1 C27.2 27.05,15.85 v27.05,16.1 | v30.3,9.3 C29.2 29.85,9.3 28.85,10.3 U5.48 | U4.1 42.9,10.6 43.44,10.06 C9.2 43.44,8.26 v43.45,8.25 | U4.29 40.75,10.35 v41,10.1 41.25,10.35 U4.30 | U4.7 43.4,14.45 43.6,14.65 C16.1 v44.48,14.65 | U4.4 43.2,12.95 43.6,13.35 C17.1 44.55,13.35 v44.6,13.3 | U4.11 41.25,17.29 C13.1 41.23,17.6 v41.25,17.63 | U4.17 37.95,15.1 C15.1 v37.95,17.63
  Top 0.2: U4.3 U4.4
  Top 0.3: LED1.2 28.69,17.14 27.4,15.85 27.05,15.85 | JP1.15 8.89,2.4 R3.2
  Top 0.5: U2.5 14.19,12.31 15.21,11.29 C8.1 C7.1 17.07,11.29 | 17.07,11.29 v17.1,11.25 | 23.45,5.6 20.36,5.6 17.14,8.82 v17.14,9.19 17.14,10.75 17.07,10.83 17.07,11.29
  Bottom 0.7: v44.6,13.3 arc-90 44.48,13.42 v44.48,14.65 44.48,15.09 arc90 41.94,17.63 v41.25,17.63 v37.95,17.63 36.42,16.1 30.3,16.1 | 30.3,16.1 v27.05,16.1 | 30.3,12.85 30.3,16.1 | 36.3,9.3 37.1,10.1 v41,10.1 41.6,10.1 v43.45,8.25 | v17.1,11.25 17.5,11.65 19,11.65
  Bottom 0.75: 30.3,12.85 v30.3,10.3 v30.3,9.3 36.3,9.3 v36.3,7.2 | v27.05,16.1 v23.45,16.1 19,11.65 v19,10.7 | v23.5,5.55 v27.05,5.55 27.3,5.3 v30.3,5.3 | JP1.15 8.89,8.29 9.79,9.19 v17.14,9.19
A0
  Top 0.152: U5.38 25.45,7.05 24.5,6.1 24.5,4.8 23.6,3.9 17.35,3.9 16.51,3.06 JP1.12
A1
  Top 0.152: U5.39 25.85,7.05 24.78,5.98 24.78,4.68 23.72,3.62 19.67,3.62 19.05,3 JP1.11
A2
  Top 0.152: U5.40 26.25,7.06 25.06,5.87 25.06,4.57 23.83,3.34 22.04,3.34 21.59,2.89 JP1.10
A3
  Top 0.152: U5.41 26.65,7.07 25.34,5.75 25.34,4.45 24.13,3.25 JP1.9
A4  (via drill 0.2)
  Top 0.152: U5.37 25.05,7.98 25.11,8.04 25.11,8.06 25.15,8.1 v25.15,8.7
  Bottom 0.152: v25.15,8.7 24.9,8.95 22.8,8.95 21.95,8.1 21.95,5.61 23.18,4.37 23.43,4.37 23.45,4.35 24.45,4.35 24.47,4.37 26.03,4.37 26.67,3.73 JP1.8
A5/!CS  (via drill 0.2)
  Top 0.152: U5.32 23.05,8.04 v22.87,8.22
  Bottom 0.152: v22.87,8.22 22.27,7.62 22.27,5.68 23.3,4.65 26.15,4.65 29.21,1.59 JP1.7
AREF  (via drill 0.2)
  Top 0.2: v24.68,2.92 24.68,3.36 25.56,4.24 26.2,4.24 26.51,3.93 28.87,3.93 29.07,4.13 29.07,5.52 28.7,5.88 C21.2 28.05,8.13 U5.43
  Top 0.3: JP1.14 11.43,2.28 R3.1
  Bottom 0.2: JP1.14 13.08,2.92 v24.68,2.92
D5  (via drill 0.2)
  Top 0.152: U5.6 25.05,14.95 25.6,15.5 25.6,18.22 v26.49,19.11
  Bottom 0.152: v26.49,19.11 26.7,19.11 27.3,19.71 38.91,19.71 39.6,20.4 39.6,21.36 JP3.10
D6  (via drill 0.2)
  Top 0.152: U5.7 24.65,14.95 25.32,15.62 25.32,18.33 25.91,18.92 v25.91,19.14
  Bottom 0.152: v25.91,19.14 26.31,19.54 26.74,19.54 27.19,19.99 36.14,19.99 36.83,20.68 JP3.9
D9
  Top 0.152: U5.8 24.25,14.95 25.04,15.74 25.04,18.88 25.99,19.82 30.95,19.82 30.97,19.8 33.5,19.8 34.5,20.8 34.5,21.38 JP3.8
D10
  Top 0.152: U5.9 23.85,14.94 24.76,15.85 24.76,18.99 25.87,20.1 30.95,20.1 31.75,20.9 JP3.7
D11
  Top 0.152: U5.11 23.05,15.28 22.93,15.4 22.93,17.56 25.76,20.38 28,20.38 JP3.6
D12
  Top 0.152: U5.12 22.65,17.67 26.57,21.59 JP3.5
D13
  Top 0.152: U5.13 22.25,15 22.37,15.12 22.37,17.79 24.13,19.54 JP3.4
D+  (via drill 0.2)
  Top 0.152: R14.1 31.48,8.3 v32.23,7.55 | J2.A6 7.07,11.68 v7.6,11.15 7.13,10.68 J2.B6
  Bottom 0.152: v32.23,7.55 32.01,7.77 27.53,7.77 25.18,10.12 14.41,10.12 13.93,10.6 8.15,10.6 v7.6,11.15
D-  (via drill 0.2)
  Top 0.152: R13.1 31.86,7.3 v32.26,6.9 | J2.A7 5.77,11.18 v5.3,11.65 v5.31,11.65 5.84,12.18 J2.B7
  Bottom 0.152: v32.26,6.9 31.67,7.49 27.36,7.49 25.01,9.84 14.19,9.84 13.77,10.27 6.68,10.27 v5.3,11.65
EN  (via drill 0.25)
  Top 0.152: R1.2 16.65,17.2 13.29,13.85 v13.29,13.61 | v8.9,9.65 10.9,9.65 11.15,9.9 11.15,10.39 U2.3
  Top 0.2: JP3.2 19.05,19.3 18.19,18.44 R1.2
  Bottom 0.152: v13.29,13.61 13.05,13.61 12.09,12.64 5.14,12.64 4.6,12.1 4.6,11.25 6.03,9.82 6.35,9.82 6.52,9.65 v8.9,9.65
GND  (via drill 0.2)
  other vias: 32.49,15.03 31.03,17.25 31.05,18.12 36.72,18.47 33.91,18.67 35.66,18.67 31.88,18.61 34.37,15.14 35.65,15.1 33.09,11.21 34.36,11.28 35.64,11.29 34.73,12.94 32.67,13.17 36.87,14.92 36.79,12.38 33.95,7.38 32.96,7.54 35.26,4.45 38.57,4.2 38.49,5.16 33.98,5.36 32.26,4.97 32.84,4.19 33.06,2.12 35.49,2.05 30.49,2.33 27.59,2.3 32.29,4.14 29.18,11.62 31.19,11.93 39.6,4.49 21.83,12.91 27,12.65 21.93,10.7 26.38,9.67 26.14,10.68 21.92,11.64 24.45,12.34 22.82,12.08 22.82,10.9 26.95,12.08 28.6,4.4 27.78,4.4 27.09,4.4 29.58,4.11 31.24,4.11 30.44,4.56 31.29,5.78 24.3,16.88 24.31,18.28 23.41,17.34 26.91,17.32 27.86,18.56 28.13,17.37 23.62,20.42 23.09,19.19 21.88,15.72 19.95,16.63 20.28,22.19 22.72,22.27 17.78,22.23 17.89,20.5 26.74,10.22 40.49,13.23 40.49,14.13 40.49,14.78 40.49,11.58 40.49,12.43 42.09,13.23 41.34,13.23 39.74,13.23 38.89,13.23 38.89,14.78 38.89,11.58 42.09,11.58 42.09,14.78 42.09,14.08 42.09,12.43 41.29,11.58 39.69,11.58 38.89,12.43 38.89,14.03 39.64,14.83 41.34,14.83 40.9,4.14 40.9,4.79 41.45,5.39 41.6,6.44 41.75,7.39 42.25,6.79 42.2,5.64 42,4.49 42.45,3.44 43.15,4.69 43.05,5.94 43.85,5.24 44.65,4.79 45.8,4.14 46.3,5.24 46.3,4.29 46.3,3.09 46.35,2.09 46.35,0.54 45.15,6.84 45.1,7.59 45.2,8.49 45.1,9.69 44.75,10.49 44.1,10.94 43.5,11.09 43.6,10.64 43.9,9.84 44.3,8.89 44.25,8.14 44.25,7.24 44.1,6.09 44,4.19 43.45,3.14 43.25,2.14 44.7,3.49 46.35,11.29 46.35,12.24 46.35,13.34 46.35,14.54 46.35,15.74 46.35,16.84 46.35,17.99 46.35,18.99 46.3,20.24 46.35,21.54 46.35,22.34 45.45,22.34 45.5,20.94 44.8,19.69 44.05,19.04 43.65,18.34 44.85,16.64 45.2,15.64 45.65,16.94 45.5,18.79 45.7,14.64 43.5,15.39 44.85,12.6 45.55,12.2 42.45,8.15 38.95,8.69 43.35,22.29 43.4,20.89 43.6,20.14 42.7,19.74 40.75,22.34 40.65,21.24 40.25,20.14 41.25,20.09 38.6,20.19 38.05,22.34 37.55,20.24 38.7,16.89 38.45,16.24 37.5,16.04 37.3,15.39 37.3,14.09 37.35,13.04 37.35,11.89 38,10.84 35.65,12.59 35.65,14.14 18.68,8.9 17.98,9.1 16.58,8.45 18.43,6.6 19.33,5.65 14.88,6.85 14.63,4.5 13.35,5.75 13.3,4.35 11.2,5.45 7.2,5.45 7.05,4.55 10,5.55 9.95,4.55 11.2,4.5 3.75,8.95 3.55,8 2.45,8.15 3.05,7.45 17.78,10.7 14.18,11.3 13.88,13.1 14.78,14.15 16.13,16 15.73,14 17.23,16.65 17.33,15.8 17.93,14.1 15.68,18.8 14.83,17.05 13.33,16.3 12.23,18.4 11.13,17.5 11.08,14.9 9.23,15 8.63,13.45 4.18,14.1 4.18,15.1 3.73,15.95 4.63,16.85 6.48,16.85 3.08,14.7 1.98,14.2 3.33,13.35 1.88,13 3.18,12.3 1.83,12.15 3.18,11.3 1.88,10.7 3.08,10 2.68,8.9 1.53,8.6 0.73,8.25 1.18,9.7 0.78,11.1 0.88,13.5 0.73,12.1 0.88,14.5 4.23,22.3 5.83,22.25 6.43,21.35 5.28,20.65 5.13,19.9 9.33,22.1 10.18,20.7 11.13,22.3 12.63,20.65 13.28,22.2 10.48,19.15 7.98,18.35 7.78,15.7 13.88,18.3 4.33,0.65 5.28,2.5 7.53,3.15 7.63,0.7 10.03,0.7 11.53,3.35 12.83,0.65 15.18,2.15 15.23,0.55 15.78,3.75 19.93,4.5 21.03,4.4 24.3,13.14 22.9,13.09 21.85,16.44 21.5,15.24 22.35,18.44 19.65,19.84 19.35,18.09 13.93,13.85 15.38,15.15 35.45,22.34 35.35,20.49 32.21,14.4 31.06,14.9 28.11,14.6 27.76,15.3 12.13,12.05 12.13,11.55 12.13,11.05 10.08,11.3 9.23,11.35 20.58,6.25 19.58,7.25 17.93,3.4 17.78,2.45 17.8,0.5 10.18,2
  pour Top (no thermals): 0,22.86 0,0 46.48,0 46.48,22.86
  pour Bottom: 46.48,0 0,0 0,22.86 46.48,22.86
I2C0_SCL  (via drill 0.2)
  Top 0.152: U5.3 26.25,15.11 26.07,15.28 26.07,18.08 v26.47,18.48
  Bottom 0.152: v26.47,18.48 27.42,19.43 41.53,19.43 41.91,19.81 JP3.11
I2C0_SDA  (via drill 0.2)
  Top 0.152: U5.2 26.65,15.1 26.35,15.4 26.35,17.75 v27.05,18.45
  Bottom 0.152: v27.05,18.45 27.75,19.15 43.5,19.15 44.45,20.1 JP3.12
LED  (via drill 0.2)
  Top 0.152: U5.15 21.02,17 21.86,17.84 v21.86,19.98 | v6.13,19.77 6.13,18.91 R7.1
  Bottom 0.152: v21.86,19.98 20.96,19.98 20.58,20.36 20.22,20.36 20.18,20.32 18.32,20.32 18.07,20.07 6.43,20.07 v6.13,19.77
N$1
  Top 0.2: CHG.C 4.52,5.39 5.14,4.77 R2.1
N$2
  Top 0.152: L.A 4.46,17.47 5.1,18.11 R7.2
N$3
  Top 0.152: R2.2 14.69,3.92 15.26,4.49 15.26,6.11 15.89,6.74 U3.1
N$4
  Top 0.2: R8.1 17.57,5.84 16.93,5.2 U3.5
N$5
  Top 0.152: U5.46 28.39,9.5 29.4,8.49 29.4,7.45 29.55,7.3 R13.2
N$6
  Top 0.152: R4.1 41.78,10.77 U4.31
N$7
  Top 0.152: U5.47 28.39,9.9 29.94,8.35 R14.2
N$8
  Top 0.152: U4.27 39.75,9.74 39.92,9.57 39.92,8.77 39.87,8.73 39.87,7.53 39.23,6.89 Q2.1 39.44,6.65 C10.1
N$9  (via drill 0.25)
  Top 0.152: U4.14 39.75,16.36 v39.7,16.4
  Top 0.2: v43.41,16.12 44.55,17.26 TP3.TP
  Bottom 0.2: v39.7,16.4 41.42,16.4 41.85,16.83 42.71,16.83 v43.41,16.12
N$10
  Top 0.152: U4.28 40.25,9.33 C11.1 40.41,8.28 Q2.3
N$11
  Top 0.2: J2.B5 7.92,9.68 R10.1
N$12
  Top 0.2: J2.A5 7.92,12.68 R12.2
N$13
  Top 0.152: U5.20 20.45,11.5 20,11.95 20,14.5 19.65,14.85 Q1.3 19.18,14.98 C2.1
N$14  (via drill 0.2)
  Top 0.152: U5.24 21.82,9.9 v22.31,9.41
  Bottom 0.152: TP1.P$1 15.37,5.54 17.92,8.1 20.21,8.1 21.53,9.42 v22.3,9.42 v22.31,9.41
N$15  (via drill 0.2)
  Top 0.152: U5.25 21.38,9.5 v21.89,8.99
  Bottom 0.152: v21.89,8.99 21.5,8.99 20.33,7.82 18.25,7.82 17.91,7.48 TP2.P$1
N$16
  Top 0.152: R5.2 17.65,11.7 16.85,12.5 Q1.1 15.7,13.25
  Top 0.254: C4.1 15.51,13.25 15.7,13.25
N$17
  Top 0.152: U5.21 20.4,11.1 19.8,11.7 R5.1
N$18  (via drill 0.2)
  Top 0.152: U5.50 29.8,11.1 29.96,11.27 C20.2 | U5.23 20.55,10.3 19.95,9.7 C19.2 19.34,9.21 v19.35,9.2 | U5.45 28.4,9.1 29.12,8.38 29.12,6.63 29.45,6.3 C5.2 30.07,6.2 v30.3,6.2
  Top 0.2: U5.45 27.49,9.1 27.22,9.37 27.22,10.84 27.48,11.1 U5.50
  Top 0.3: v22.75,6.3 22.7,6.35 21.2,6.35 19.34,8.21 19.34,9.21
  Bottom 0.3: v30.3,6.2 27.32,6.2 22.85,6.2 v22.75,6.3
N$123
  Top 0.152: U4.13 40.23,15.62 R11.1
NEOPIXEL
  Top 0.152: LED1.1 30.44,17.69 29.5,16.75 29.5,15 28.34,13.84 27.46,13.84 26.43,12.8 25.45,12.8 24.57,13.69 22.1,13.69 21.85,13.94 U5.14
QSPI_SCLK
  Top 0.152: U5.52 28.39,11.9 29.58,13.09 31.65,13.09 31.95,12.79 31.95,8.65 32.1,8.5 33.4,8.5 33.72,8.82 U1.6
QSPI_SD0
  Top 0.152: U5.53 28.39,12.3 29.47,13.37 31.8,13.37 32.35,12.82 32.35,9.97 U1.5
QSPI_SD1
  Top 0.152: U5.55 28.41,13.1 29.23,13.93 32.63,13.93 33.1,14.4 33.1,17.65 33.35,17.9 34.75,17.9 34.99,17.66 U1.2
QSPI_SD2
  Top 0.152: U5.54 28.4,12.7 29.35,13.65 33.05,13.65 33.72,14.32 U1.3
QSPI_SD3
  Top 0.152: U5.51 28.38,11.5 29.7,12.81 31.51,12.81 31.67,12.65 31.67,8.53 31.98,8.22 34.47,8.22 34.99,8.74 U1.7
RF1
  Top 0.3: U4.2 43.55,11.95
  Top 0.75: 43.55,11.95 arc-90 45.98,9.52 Z2.2 Z3.2
RF2
  Top 0.7: Z1.2 48.62,6.17 arc90 49.45,7
  Top 0.75: Z3.1 Z1.2
  Top 0.9: 49.45,7 49.45,7.38 arc90 ANT1.1
RP2040_RXD  (via drill 0.2)
  Top 0.152: U5.5 25.45,13.53 v25.75,13.23 | v38.38,6.3 38.5,6.42 38.5,9.75 39.25,10.5 U4.26
  Bottom 0.152: v25.75,13.23 25.97,13.01 25.97,11.93 29.46,8.44 33.84,8.44 36.02,6.27 38.33,6.27 38.34,6.26 v38.38,6.3
RP2040_TXD  (via drill 0.2)
  Top 0.152: U5.4 25.85,13.95 v26.25,13.55 | v38.05,7.2 38.15,7.3 38.15,10 38.75,10.6 U4.25
  Bottom 0.152: v26.25,13.55 26.25,12.05 29.58,8.72 33.96,8.72 36.13,6.55 37.7,6.55 38.05,6.9 v38.05,7.2
RX  (via drill 0.2)
  Top 0.152: U5.28 21.07,8.25 21.07,7.37 v21,7.3 | v25.5,3.35 38.4,3.35 39.37,2.38 JP1.3
  Bottom 0.152: v21,7.3 21,6.65 21.35,6.3 21.35,4.85 22.85,3.35 v25.5,3.35
SCK  (via drill 0.2)
  Top 0.152: U5.34 23.85,8.05 v23.5,8.4
  Bottom 0.152: v23.5,8.4 23.5,8.35 25.2,6.65 31.05,6.65 31.75,5.95 JP1.6
SDI  (via drill 0.2)
  Top 0.152: U5.36 24.65,8.19 v24.68,8.22
  Bottom 0.152: v24.68,8.22 24.68,7.96 25.43,7.21 31.34,7.21 36.83,1.72 JP1.4
SDO  (via drill 0.2)
  Top 0.152: U5.35 24.25,8.4 v24.15,8.5
  Bottom 0.152: v24.15,8.5 24.25,8.4 24.25,8 25.32,6.93 31.22,6.93 34.29,3.85 JP1.5
SLEEP
  Top 0.2: U4.8 R9.2
TX  (via drill 0.2)
  Top 0.152: U5.27 21.5,8.7 21.75,8.45 21.75,8.15 21.43,7.83 v21.43,6.85 | v25.95,3.78 26.1,3.63 41.12,3.63 41.91,2.84 JP1.2
  Bottom 0.152: v21.43,6.85 21.63,6.65 21.63,4.96 22.97,3.63 25.17,3.63 25.32,3.78 v25.95,3.78
VBAT
  Top 0.5: JP3.1 16.86,21.25 D1.A 16.86,18.05 14.4,15.6 X1.2 12.2,13 12.75,12.45 12.75,9.6 12.45,9.3 12.45,8.53 | C3.1 12.2,8.53 12.45,8.53 | U3.3 13.27,8.53 12.45,8.53
VBUS  (via drill 0.2, 0.25)
  Top 0.2: R1.1 20.18,17.2 v20.55,17.57 D1.C | CHG.A 4.4,7.97 4.4,9.85
  Top 0.3: J2.B4/A9 5.72,9.03 5.33,9.42 4.8,9.42 | 4.87,13.48 4.98,13.59 5.48,13.59 5.72,13.83 J2.A4/B9
  Top 0.5: JP3.3 20.55,20.55 D1.C | J2.A4/B9 6.99,13.83 7.47,14.31 8.78,14.31 9.32,13.77 9.32,13.15 9.56,12.91 C6.1 9.67,12.31 U2.1 11.13,13.08 v11.15,13.1 | 4.87,13.48 4.4,13.01 4.4,9.85 4.4,9.82 v4.71,9.51 4.8,9.42 | U3.4 13.99,6.26 12.99,7.26 9.8,7.26 9.24,7.82 v7.71,7.82
  Bottom 0.5: v7.71,7.82 6.16,9.37 5.84,9.37 5.7,9.51 v4.71,9.51 | v11.15,13.1 11.9,13.1 16.12,17.32 20.3,17.32 v20.55,17.57
WIFI_BOOT  (via drill 0.2)
  Top 0.152: U5.16 20.55,13.1 20.38,13.27 20.38,15.68 v20.4,15.7 | U4.15 39.25,18.25 v39.1,18.4
  Bottom 0.152: v20.4,15.7 23.41,18.71 25.63,18.71 26.32,18.02 27.93,18.02 28.78,18.87 31.01,18.87 31.84,18.04 36.9,18.04 37.26,18.4 v39.1,18.4

### Text on the board
tPlace: BAT | En | USB | 13 | 12 | 11 | ~ | 10 | ~ | 9 | ~ | 6 | ~5 | SCL | SDA | #8 | CHG | RESET | BOOT | RST | 3V | ARf | GND | A0 | A1 | A2 | A3 | A4 | A5 | SCK | SDO | SDI | RX | TX | GND
bPlace: 4.2V / Li-Po Battery / USB charge | BAT | En | USB | 13 | 12 | 11~ | 10~ | 9~ | 6 | 5~ | SCL | SDA | Model: 2040 | swclk | swdio | RST | 3V | ARf | GND | A0 | A1 | A2 | A3 | A4 | A5 | SCK | SDO | SDI | RX | TX | GND
Instructions: No TABS here